# EAGLE schematic PIC18F44K22 KONTROL KART (EAGLE 9.6.2)
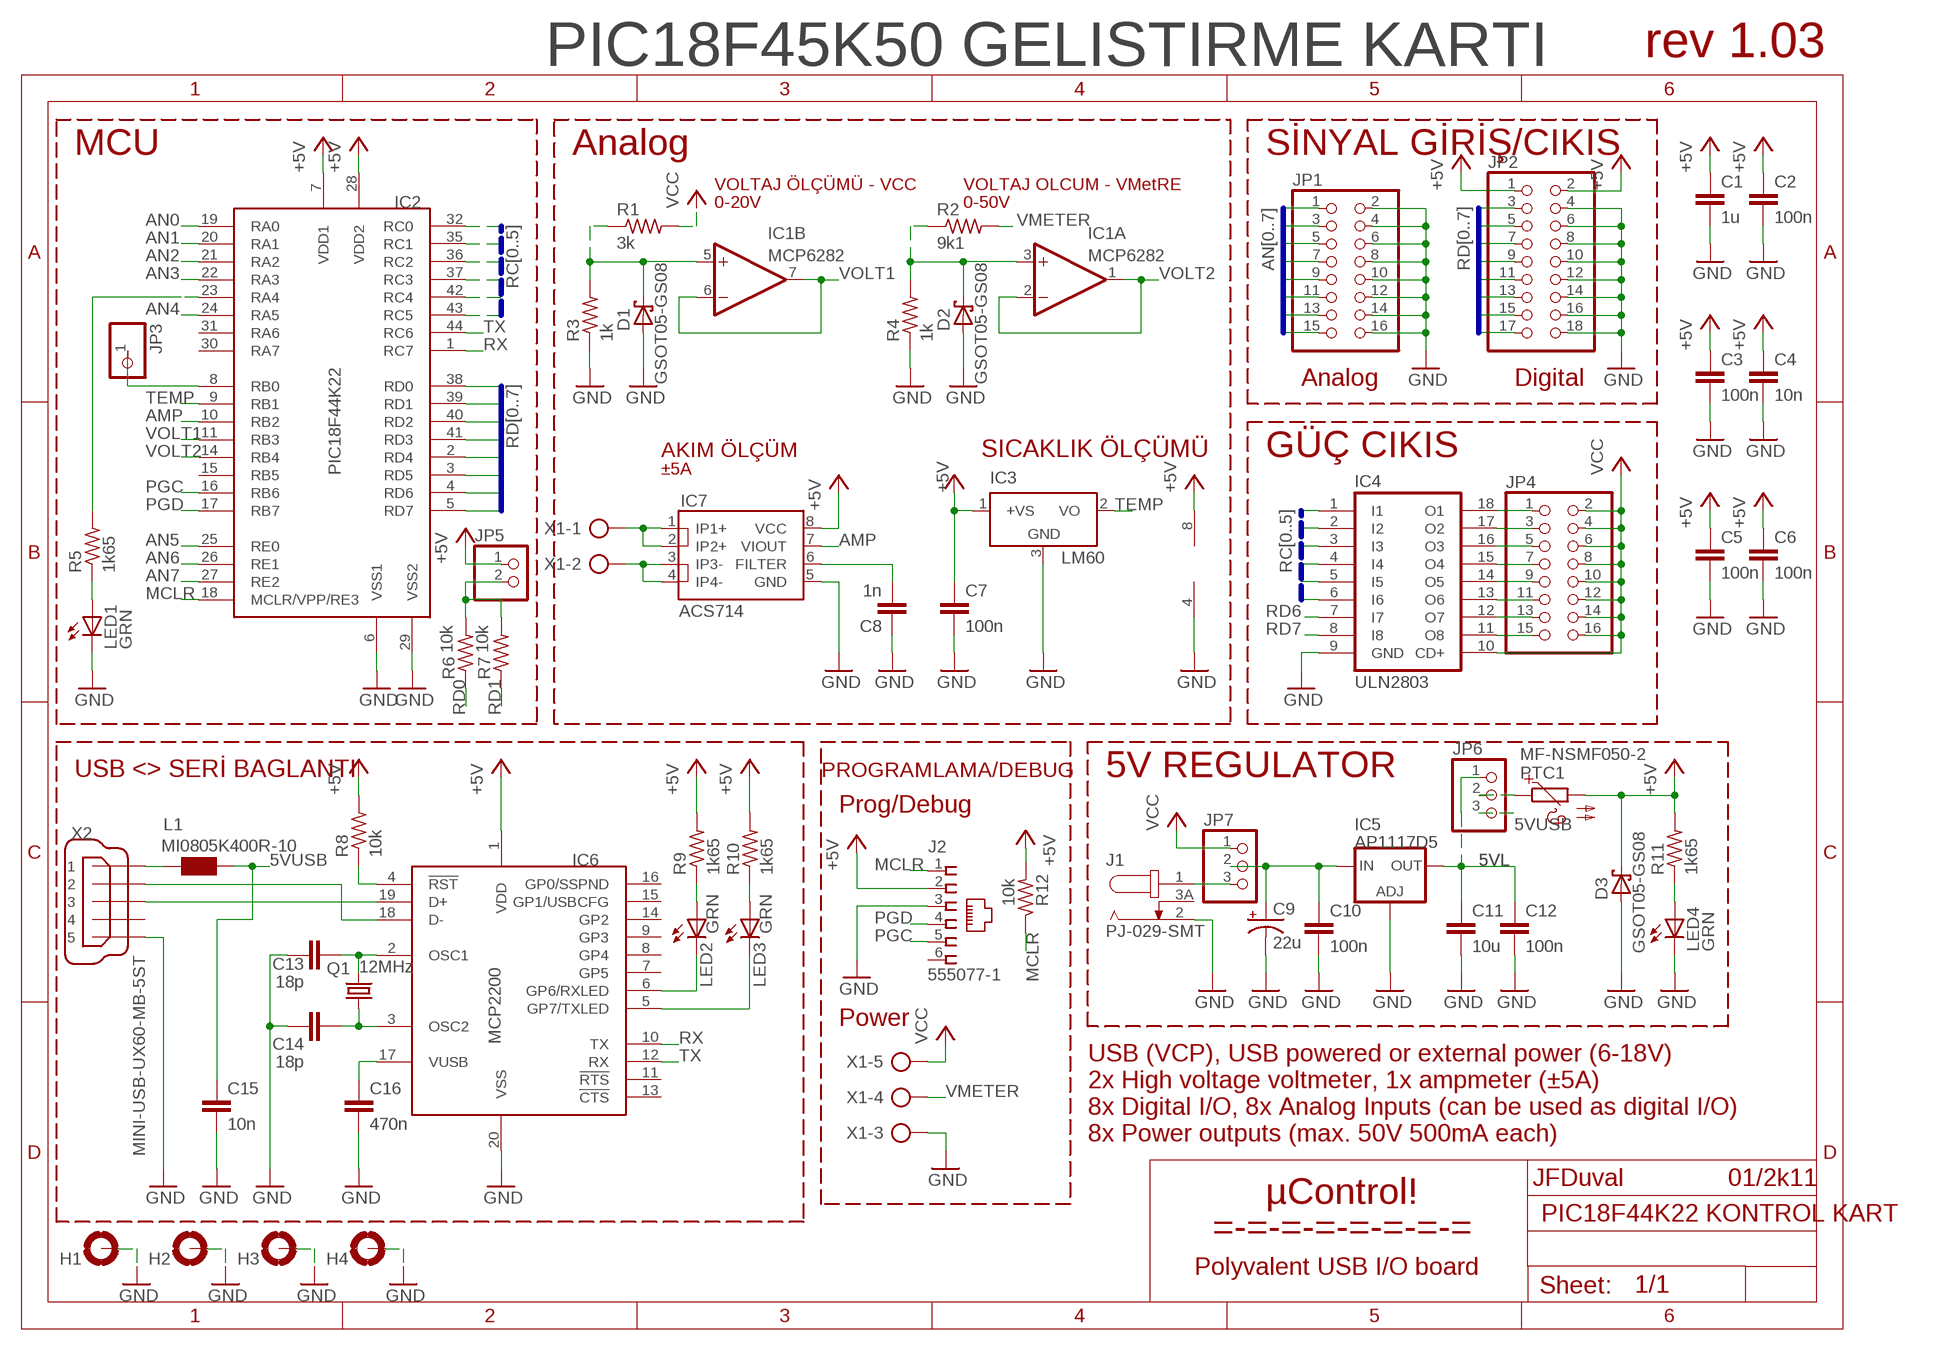
[diagram p0: schematic, sheet 1]

## Parts
C1  1u  C-EUC0603  [C0603]
C2  100n  C-EUC0603  [C0603]
C3  100n  C-EUC0603  [C0603]
C4  10n  C-EUC0603  [C0603]
C5  100n  C-EUC0603  [C0603]
C6  100n  C-EUC0603  [C0603]
C7  100n  C-EUC0603  [C0603]
C8  1n  C-EUC0603  [C0603]
C9  22u  CPOL-US153CLV-0505  [153CLV-0505]
C10  100n  C-EUC0603  [C0603]
C11  10u  C-EUC0805  [C0805]
C12  100n  C-EUC0603  [C0603]
C13  18p  C-EUC0603  [C0603]
C14  18p  C-EUC0603  [C0603]
C15  10n  C-EUC0603  [C0603]
C16  470n  C-EUC0603  [C0603]
D1  GSOT05-GS08  BAS70  [SOT23]
D2  GSOT05-GS08  BAS70  [SOT23]
D3  GSOT05-GS08  BAS70  [SOT23]
H1  MOUNT-PAD-ROUND3.2  [3,2-PAD]
H2  MOUNT-PAD-ROUND3.2  [3,2-PAD]
H3  MOUNT-PAD-ROUND3.2  [3,2-PAD]
H4  MOUNT-PAD-ROUND3.2  [3,2-PAD]
IC1  MCP6282  MCP602SN  [SO08]
IC2  PIC18F44K22  [TQFP44]
IC3  LM60  LM50  [SOT23]
IC4  ULN2803  [SO18]
IC5  AP1117D5  LD117ADT33TR  [DPACK]
IC6  MCP2200  [SSOP20]
IC7  ACS714  ACS712  [SO08]
J1  PJ-029-SMT  [SMT]
J2  555077-1  [555077-1]
JP1  PINHD-2X8  [2X08]
JP2  PINHD-2X9  [2X09]
JP3  PINHD-1X1  [1X01]
JP4  PINHD-2X8  [2X08]
JP5  PINHD-1X2  [1X02]
JP6  PINHD-1X3  [1X03]
JP7  PINHD-1X3  [1X03]
L1  MI0805K400R-10  WE-CBF_0805  [0805]
LED1  GRN  LEDCHIPLED_0603  [CHIPLED_0603]
LED2  GRN  LEDCHIPLED_0603  [CHIPLED_0603]
LED3  GRN  LEDCHIPLED_0603  [CHIPLED_0603]
LED4  GRN  LEDCHIPLED_0603  [CHIPLED_0603]
PTC1  MF-NSMF050-2  GENERIC_1206  [1206]
Q1  12MHz  CRYSTALHC49UP  [HC49UP]
R1  3k  R-US_R0603  [R0603]
R2  9k1  R-US_R0603  [R0603]
R3  1k  R-US_R0603  [R0603]
R4  1k  R-US_R0603  [R0603]
R5  1k65  R-US_R0603  [R0603]
R6  10k  R-US_R0603  [R0603]
R7  10k  R-US_R0603  [R0603]
R8  10k  R-US_R0603  [R0603]
R9  1k65  R-US_R0603  [R0603]
R10  1k65  R-US_R0603  [R0603]
R11  1k65  R-US_R0603  [R0603]
R12  10k  R-US_R0603  [R0603]
X1  OSTTE-5  [OSTTE-5]
X2  MINI-USB-UX60-MB-5ST  [UX60-MB-5ST]

## Nets
5VL: C11.1 C12.1 IC5.4(OUT) JP6.1
5VUSB: C15.1 JP6.3 L1.1
+5V: C1.1 C2.1 C3.1 C4.1 C5.1 C6.1 C7.1 D3.3(C) IC1.8(P:V+) IC2.7(VDD1) IC2.28(VDD2) IC3.1(+VS) IC6.1(VDD) IC7.8(VCC) J2.2 JP2.1 JP2.2 JP5.1 PTC1.2 R8.2 R9.2 R10.2 R11.2 R12.2
ALIVE: IC2.23(RA4) R5.2
AMP: IC2.10(RB2) IC7.7(VIOUT)
AN0: IC2.19(RA0) JP1.15
AN1: IC2.20(RA1) JP1.13
AN2: IC2.21(RA2) JP1.11
AN3: IC2.22(RA3) JP1.9
AN4: IC2.24(RA5) JP1.7
AN5: IC2.25(RE0) JP1.5
AN6: IC2.26(RE1) JP1.3
AN7: IC2.27(RE2) JP1.1
D+: IC6.19(D+) X2.3
D-: IC6.18(D-) X2.2
GND: C1.2 C2.2 C3.2 C4.2 C5.2 C6.2 C7.2 C8.1 C9.- C10.2 C11.2 C12.2 C13.1 C14.1 C15.2 C16.2 D1.1(A) D2.1(A) D3.1(A) H1.B3,2(MOUNT) H2.B3,2(MOUNT) H3.B3,2(MOUNT) H4.B3,2(MOUNT) IC1.4(P:V-) IC2.6(VSS1) IC2.29(VSS2) IC3.3(GND) IC4.9(GND) IC5.1(ADJ) IC6.20(VSS) IC7.5(GND) J1.2 J2.3 JP1.2 JP1.4 JP1.6 JP1.8 JP1.10 JP1.12 JP1.14 JP1.16 JP2.4 JP2.6 JP2.8 JP2.10 JP2.12 JP2.14 JP2.16 JP2.18 LED1.C LED4.C R3.1 R4.1 X1.3 X2.5
IS1: IC7.1(IP1+) IC7.2(IP2+) X1.1
IS2: IC7.3(IP3-) IC7.4(IP4-) X1.2
MCLR: IC2.18(MCLR/VPP/RE3) J2.1 R12.1
N$1: C13.2 IC6.2(OSC1) Q1.2
N$2: C14.2 IC6.3(OSC2) Q1.1
N$3: JP5.2 R6.2 R7.2
N$4: LED4.A R11.1
N$5: JP6.2 PTC1.1
N$6: LED1.A R5.1
N$7: L1.2 X2.1
N$8: C8.2 IC7.6(FILTER)
N$9: IC2.8(RB0) JP3.1
N$10: D1.3(C) IC1.5(B:+IN) R1.1 R3.2
N$12: C9.+ C10.1 IC5.3(IN) JP7.2
N$13: D2.3(C) IC1.3(A:+IN) R2.1 R4.2
N$15: IC6.4(!RST) R8.1
N$16: IC6.5(GP7/TXLED) LED3.C
N$17: IC6.6(GP6/RXLED) LED2.C
N$18: LED2.A R9.1
N$19: LED3.A R10.1
N$20: C16.1 IC6.17(VUSB)
N$72: J1.1 JP7.3
P0: IC4.13(O6) JP4.11
P1: IC4.14(O5) JP4.9
P2: IC4.15(O4) JP4.7
P3: IC4.16(O3) JP4.5
P4: IC4.17(O2) JP4.3
P5: IC4.18(O1) JP4.1
PD6: IC4.12(O7) JP4.13
PD7: IC4.11(O8) JP4.15
PGC: IC2.16(RB6) J2.5
PGD: IC2.17(RB7) J2.4
RC0: IC2.32(RC0) IC4.6(I6)
RC1: IC2.35(RC1) IC4.5(I5)
RC2: IC2.36(RC2) IC4.4(I4)
RC3: IC2.37(RC3) IC4.3(I3)
RC4: IC2.42(RC4) IC4.2(I2)
RC5: IC2.43(RC5) IC4.1(I1)
RD0: IC2.38(RD0) JP2.17 R6.1
RD1: IC2.39(RD1) JP2.15 R7.1
RD2: IC2.40(RD2) JP2.13
RD3: IC2.41(RD3) JP2.11
RD4: IC2.2(RD4) JP2.9
RD5: IC2.3(RD5) JP2.7
RD6: IC2.4(RD6) IC4.7(I7) JP2.5
RD7: IC2.5(RD7) IC4.8(I8) JP2.3
RX: IC2.1(RC7) IC6.10(TX)
TEMP: IC2.9(RB1) IC3.2(VO)
TX: IC2.44(RC6) IC6.12(RX)
VCC: IC4.10(CD+) JP4.2 JP4.4 JP4.6 JP4.8 JP4.10 JP4.12 JP4.14 JP4.16 JP7.1 R1.2 X1.5
VMETER: R2.2 X1.4
VOLT1: IC1.6(B:-IN) IC1.7(B:OUT) IC2.11(RB3)
VOLT2: IC1.1(A:OUT) IC1.2(A:-IN) IC2.14(RB4)
Unconnected: IC2.15(RB5) IC2.30(RA7) IC2.31(RA6) IC6.7(GP5) IC6.8(GP4) IC6.9(GP3) IC6.11(!RTS) IC6.13(!CTS) IC6.14(GP2) IC6.15(GP1/USBCFG) IC6.16(GP0/SSPND) J1.3A J2.6 X2.4

## Buses
RC[0..5]
RD[0..7]
AN[0..7]

## Notes on the sheet
- rev 1.03
- PIC18F45K50 GELISTIRME KARTI
- MCU | Analog | SİNYAL GİRİŞ/CIKIS
- VOLTAJ ÖLÇÜMÜ - VCC | VOLTAJ OLCUM - VMetRE
- 0-20V | 0-50V
- Analog | Digital
- AKIM ÖLÇÜM | SICAKLIK ÖLÇÜMÜ | GÜÇ CIKIS
- ±5A
- USB <> SERİ BAGLANTI | PROGRAMLAMA/DEBUG | 5V REGULATOR
- Prog/Debug
- Power
- USB (VCP), USB powered or external power (6-18V)
- 2x High voltage voltmeter, 1x ampmeter (±5A)
- 8x Digital I/O, 8x Analog Inputs (can be used as digital I/O)
- 8x Power outputs (max. 50V 500mA each)
- JFDuval | 01/2k11
- µControl!
- =-=-=-=-=-=-=-=
- Polyvalent USB I/O board

## Library data of the parts
C1-C8 C10-C16 = rcl:C-EU: CAPACITOR, European symbol
C9 = rcl:CPOL-US: POLARIZED CAPACITOR, American symbol
D1-D3 = diode:BAS70: Silicon Schottky Diodes General-purpose diode for high-speed switching
H1-H4 = holes:MOUNT-PAD-ROUND: MOUNTING PAD, round
IC1 = linear:MCP602: Single Op Amp 2.7V to 6.0V Single Supply CMOS Source: http://ww1.microchip.com/downloads/en/DeviceDoc/21314g.pdf
IC2 = microchip-18f44k22:PIC18F44K22
IC3 = linear:LM50: SOT-23 Single-Supply Centigrade Temperature Sensor Vout = (10mV/°C x Temp °C) +5mmmV Source: http://cache.national.com/ds/LM/LM50.pdf
IC4 = jfduval:ULN2803
IC5 = v-reg:LD117A?*: Low drop fixed and adjustable positive voltage regulators 1 A Source: http://www.st.com/stonline/products/literature/ds/7194/ld1117axx.pdf
IC6 = mcp2200-2:MCP2200
IC7 = Drive Comp:ACS712: http://www.allegromicro.com/en/Products/Part_Numbers/0712/
J1 = con-jack:PJ-029-SMT
J2 = con-amp:555077-1: AMP connector
JP1 JP4 = pinhead:PINHD-2X8: PIN HEADER
JP2 = pinhead:PINHD-2X9: PIN HEADER
JP3 = pinhead:PINHD-1X1: PIN HEADER
JP5 = pinhead:PINHD-1X2: PIN HEADER
JP6 JP7 = pinhead:PINHD-1X3: PIN HEADER
L1 = wuerth-elektronik:WE-CBF: SMD EMI Suppression Ferrite Beads - excellent anti-EMI properties - low DCR - impedances till 3000 ohms - rated current up to 6 A
LED1-LED4 = led:LED: LED OSRAM: - CHIPLED LG R971, LG N971, LY N971, LG Q971, LY Q971, LO R971, LY R971 LH N974, LH R974 LS Q976, LO Q976, LY Q976 LO Q996 - Hyper CHIPLED LW Q18S LB Q993, LB Q99A, LB R99A - SideLED LS A670, LO A670, LY A670, LG A670, LP A670 LB A673, LV A673, LT A673, LW A673 LH A674 LY A675 LS A676, LA A676, LO A676, LY A676, LW A676 LS A679, LY A679, LG A679 - Hyper Micro SIDELED® LS Y876, LA Y876, LO Y876, LY Y876 LT Y87S - SmartLED LW L88C, LW L88S LB L89C, LB L89S, LG L890 LS L89K, LO L89K, LY L89K LS L896, LA L896, LO L896, LY L896 - TOPLED LS T670, LO T670, LY T670, LG T670, LP T670 LSG T670, LSP T670, LSY T670, LOP T670, LYG T670 LG T671, LOG T671, LSG T671 LB T673, LV T673, LT T673, LW T673 LH T674 LS T676, LA T676, LO T676, LY T676, LB T676, LH T676, LSB T676, LW T676 LB T67C, LV T67C, LT T67C, LS T67K, LO T67K, LY T67K, LW E67C LS E67B, LA E67B, LO E67B, LY E67B, LB E67C, LV E67C, LT E67C LW T67C LS T679, LY T679, LG T679 LS T770, LO T770, LY T770, LG T770, LP T770 LB T773, LV T773, LT T773, LW T773 LH T774 LS E675, LA E675, LY E675, LS T675 LS T776, LA T776, LO T776, LY T776, LB T776 LHGB T686 LT T68C, LB T68C - Hyper Mini TOPLED® LB M676 - Mini TOPLED Santana® LG M470 LS M47K, LO M47K, LY M47K Source: http://www.osram.convergy.de LUXEON: - LUMILED® LXK2-PW12-R00, LXK2-PW12-S00, LXK2-PW14-U00, LXK2-PW14-V00 LXK2-PM12-R00, LXK2-PM12-S00, LXK2-PM14-U00 LXK2-PE12-Q00, LXK2-PE12-R00, LXK2-PE12-S00, LXK2-PE14-T00, LXK2-PE14-U00 LXK2-PB12-K00, LXK2-PB12-L00, LXK2-PB12-M00, LXK2-PB14-N00, LXK2-PB14-P00, LXK2-PB14-Q00 LXK2-PR12-L00, LXK2-PR12-M00, LXK2-PR14-Q00, LXK2-PR14-R00 LXK2-PD12-Q00, LXK2-PD12-R00, LXK2-PD12-S00 LXK2-PH12-R00, LXK2-PH12-S00 LXK2-PL12-P00, LXK2-PL12-Q00, LXK2-PL12-R00 Source: www.luxeon.com KINGBRIGHT: KA-3528ASYC Source: www.kingbright.com
PTC1 = ptc-ntc:GENERIC_1206
Q1 = crystal:CRYSTAL: CRYSTAL
R1-R12 = rcl:R-US_: RESISTOR, American symbol
X1 = con-terminal-ostte:OSTTE-5
X2 = con-hirose2:MINI-USB-: MINI USB Connector Source: http://www.hirose.co.jp/cataloge_hp/e24000019.pdf

## Net classes
0 default: width 0.152 mm, drill 0.381 mm, clearance 0.152 mm